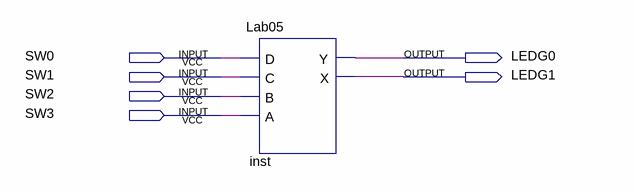
[diagram p0: schematic sheet]
// Quartus schematic testEncoder.bdf as structural Verilog: 1 symbols, 6 pins
module testEncoder (
  input  SW0,
  input  SW1,
  input  SW2,
  input  SW3,
  output LEDG0,
  output LEDG1
);

  Lab05 inst (.D(SW0), .C(SW1), .B(SW2), .A(SW3), .Y(LEDG0), .X(LEDG1));
endmodule
